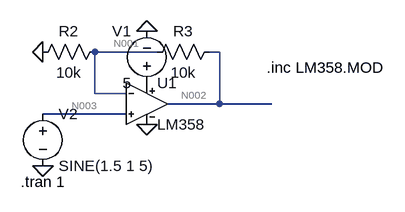
[diagram p0: schematic Draft1.asc]
Draft1.asc, the LTspice schematic file:
Version 4
SHEET 1 880 680
WIRE 240 96 144 96
WIRE 336 96 320 96
WIRE 144 160 144 96
WIRE 192 160 144 160
WIRE 336 176 336 96
WIRE 336 176 256 176
WIRE 416 176 336 176
WIRE 192 192 64 192
FLAG 224 208 0
FLAG 224 64 0
FLAG 64 272 0
FLAG 64 96 0
DATAFLAG 160 192 ""
DATAFLAG 160 192 ""
DATAFLAG 160 192 ""
DATAFLAG 160 192 ""
SYMBOL voltage 224 160 R180
WINDOW 0 24 96 Left 2
WINDOW 3 24 16 Left 2
WINDOW 123 0 0 Left 2
WINDOW 39 0 0 Left 2
SYMATTR InstName V1
SYMATTR Value 5
SYMBOL voltage 64 176 R0
WINDOW 123 0 0 Left 2
WINDOW 39 0 0 Left 2
SYMATTR InstName V2
SYMATTR Value SINE(1.5 1 5)
SYMBOL res 160 80 R90
WINDOW 0 0 56 VBottom 2
WINDOW 3 32 56 VTop 2
SYMATTR InstName R2
SYMATTR Value 10k
SYMBOL res 336 80 R90
WINDOW 0 0 56 VBottom 2
WINDOW 3 32 56 VTop 2
SYMATTR InstName R3
SYMATTR Value 10k
SYMBOL LM358\\LM358 224 112 R0
SYMATTR InstName U1
TEXT 30 296 Left 2 !.tran 1
TEXT 408 120 Left 2 !.inc LM358.MOD

The netlist it stands for:
* Draft1.asc
V1 P001 0 5
V2 N003 0 SINE(1.5 1 5)
R2 N001 0 10k
R3 N002 N001 10k
XU1 N001 N003 N002 P001 0 LM358  ; pins In- In+ OUT V+ V-
.tran 1
.inc LM358.MOD
.lib LM358.MOD
.backanno
.end

* Results of the author's LTspice run, read from the files saved beside the schematic
* Operating Point, zero values left out:
*   V(p001) = 5 V
*   V(n003) = 1.5 V
*   V(n001) = 1.5 V
*   V(n002) = 3 V
*   I(R3) = 150 µA
*   I(R2) = 150 µA
*   I(V2) = 9.999 nA
*   I(V1) = -340.5 µA
*   Ix(u1:1) = -10 nA
*   Ix(u1:2) = -9.999 nA
*   Ix(u1:3) = -150 µA
*   Ix(u1:4) = 340.5 µA
*   Ix(u1:5) = -190.5 µA
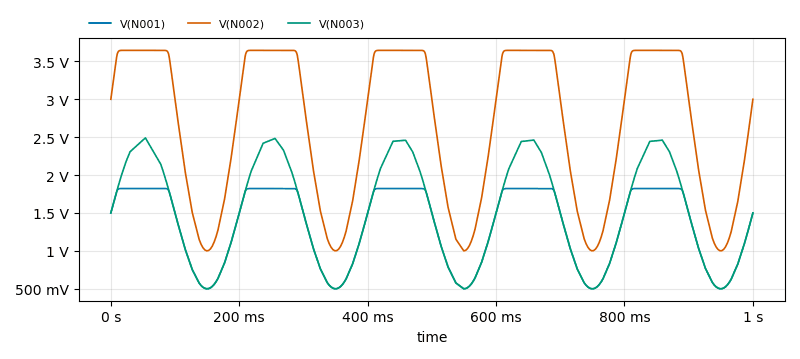
[diagram p1: Transient Analysis of Draft1.asc, plotted from the saved traces]
* Transient Analysis, 1 run:
*   V(N001): min 500.3 mV, max 1.822 V, average 1.328 V, rms 1.425 V, last 1.5 V
*   V(N002): min 1.001 V, max 3.645 V, average 2.655 V, rms 2.849 V, last 3 V
*   V(N003): min 500.3 mV, max 2.491 V, average 1.495 V, rms 1.651 V, last 1.5 V